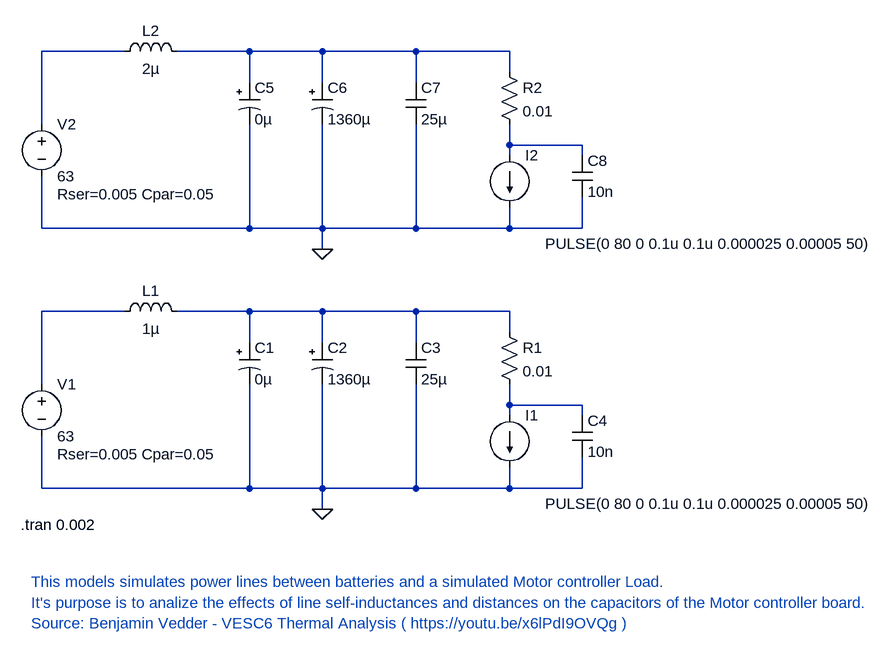
[diagram p0: schematic Motor_controller_power_line_001.asc]
Motor_controller_power_line_001.asc, the LTspice schematic file:
Version 4
SHEET 1 1240 680
WIRE -16 -416 -144 -416
WIRE 176 -416 64 -416
WIRE 288 -416 176 -416
WIRE 432 -416 288 -416
WIRE 576 -416 432 -416
WIRE 576 -384 576 -416
WIRE 176 -368 176 -416
WIRE 288 -368 288 -416
WIRE 432 -368 432 -416
WIRE -144 -304 -144 -416
WIRE 576 -272 576 -304
WIRE 688 -272 576 -272
WIRE 576 -256 576 -272
WIRE 688 -256 688 -272
WIRE -144 -144 -144 -224
WIRE 176 -144 176 -304
WIRE 176 -144 -144 -144
WIRE 288 -144 288 -304
WIRE 288 -144 176 -144
WIRE 432 -144 432 -304
WIRE 432 -144 288 -144
WIRE 576 -144 576 -176
WIRE 576 -144 432 -144
WIRE 688 -144 688 -192
WIRE 688 -144 576 -144
WIRE 288 -112 288 -144
WIRE -16 -16 -144 -16
WIRE 176 -16 64 -16
WIRE 288 -16 176 -16
WIRE 432 -16 288 -16
WIRE 576 -16 432 -16
WIRE 576 16 576 -16
WIRE 176 32 176 -16
WIRE 288 32 288 -16
WIRE 432 32 432 -16
WIRE -144 96 -144 -16
WIRE 576 128 576 96
WIRE 688 128 576 128
WIRE 576 144 576 128
WIRE 688 144 688 128
WIRE -144 256 -144 176
WIRE 176 256 176 96
WIRE 176 256 -144 256
WIRE 288 256 288 96
WIRE 288 256 176 256
WIRE 432 256 432 96
WIRE 432 256 288 256
WIRE 576 256 576 224
WIRE 576 256 432 256
WIRE 688 256 688 208
WIRE 688 256 576 256
WIRE 288 288 288 256
FLAG 288 288 0
FLAG 288 -112 0
SYMBOL voltage -144 80 R0
WINDOW 123 0 0 Left 2
WINDOW 39 24 124 Left 2
SYMATTR SpiceLine Rser=0.005 Cpar=0.05
SYMATTR InstName V1
SYMATTR Value 63
SYMBOL ind -32 0 R270
WINDOW 0 32 56 VTop 2
WINDOW 3 5 56 VBottom 2
SYMATTR InstName L1
SYMATTR Value 1µ
SYMATTR SpiceLine Rser=0.01
SYMBOL polcap 160 32 R0
SYMATTR InstName C1
SYMATTR Value 0µ
SYMATTR SpiceLine V=100 Rser=0.002 Lser=0.1u
SYMBOL polcap 272 32 R0
SYMATTR InstName C2
SYMATTR Value 1360µ
SYMATTR SpiceLine V=100 Rser=0.01 Lser=0.01u
SYMBOL cap 416 32 R0
SYMATTR InstName C3
SYMATTR Value 25µ
SYMATTR SpiceLine V=100 Rser=0.0002 Lser=0.001u
SYMBOL current 576 144 R0
WINDOW 3 55 136 Left 2
WINDOW 123 0 0 Left 2
WINDOW 39 0 0 Left 2
SYMATTR Value PULSE(0 80 0 0.1u 0.1u 0.000025 0.00005 50)
SYMATTR InstName I1
SYMBOL cap 672 144 R0
SYMATTR InstName C4
SYMATTR Value 10n
SYMATTR SpiceLine V=100 Rser=0.0002 Lser=0.001u
SYMBOL res 560 0 R0
SYMATTR InstName R1
SYMATTR Value 0.01
SYMBOL voltage -144 -320 R0
WINDOW 123 0 0 Left 2
WINDOW 39 24 124 Left 2
SYMATTR SpiceLine Rser=0.005 Cpar=0.05
SYMATTR InstName V2
SYMATTR Value 63
SYMBOL ind -32 -400 R270
WINDOW 0 32 56 VTop 2
WINDOW 3 5 56 VBottom 2
SYMATTR InstName L2
SYMATTR Value 2µ
SYMATTR SpiceLine Rser=0.01
SYMBOL polcap 160 -368 R0
SYMATTR InstName C5
SYMATTR Value 0µ
SYMATTR SpiceLine V=100 Rser=0.002 Lser=0.1u
SYMBOL polcap 272 -368 R0
SYMATTR InstName C6
SYMATTR Value 1360µ
SYMATTR SpiceLine V=100 Rser=0.01 Lser=0.01u
SYMBOL cap 416 -368 R0
SYMATTR InstName C7
SYMATTR Value 25µ
SYMATTR SpiceLine V=100 Rser=0.0002 Lser=0.001u
SYMBOL cap 672 -256 R0
SYMATTR InstName C8
SYMATTR Value 10n
SYMATTR SpiceLine V=100 Rser=0.0002 Lser=0.001u
SYMBOL res 560 -400 R0
SYMATTR InstName R2
SYMATTR Value 0.01
SYMBOL current 576 -256 R0
WINDOW 3 55 136 Left 2
WINDOW 123 0 0 Left 2
WINDOW 39 0 0 Left 2
SYMATTR Value PULSE(0 80 0 0.1u 0.1u 0.000025 0.00005 50)
SYMATTR InstName I2
TEXT -176 312 Left 2 !.tran 0.002
TEXT -160 400 Left 2 ;This models simulates power lines between batteries and a simulated Motor controller Load.
TEXT -160 432 Left 2 ;It's purpose is to analize the effects of line self-inductances and distances on the capacitors of the Motor controller board.
TEXT -160 464 Left 2 ;Source: Benjamin Vedder - VESC6 Thermal Analysis ( https://youtu.be/x6lPdI9OVQg )

The netlist it stands for:
* Motor_controller_power_line_001.asc
V1 N004 0 63 Rser=0.005 Cpar=0.05
L1 N004 N005 1µ Rser=0.01
C1 N005 0 0µ V=100 Rser=0.002 Lser=0.1u
C2 N005 0 1360µ V=100 Rser=0.01 Lser=0.01u
C3 N005 0 25µ V=100 Rser=0.0002 Lser=0.001u
I1 N006 0 PULSE(0 80 0 0.1u 0.1u 0.000025 0.00005 50)
C4 N006 0 10n V=100 Rser=0.0002 Lser=0.001u
R1 N005 N006 0.01
V2 N001 0 63 Rser=0.005 Cpar=0.05
L2 N001 N002 2µ Rser=0.01
C5 N002 0 0µ V=100 Rser=0.002 Lser=0.1u
C6 N002 0 1360µ V=100 Rser=0.01 Lser=0.01u
C7 N002 0 25µ V=100 Rser=0.0002 Lser=0.001u
C8 N003 0 10n V=100 Rser=0.0002 Lser=0.001u
R2 N002 N003 0.01
I2 N003 0 PULSE(0 80 0 0.1u 0.1u 0.000025 0.00005 50)
.tran 0.002
* This models simulates power lines between batteries and a simulated Motor controller Load.
* It's purpose is to analize the effects of line self-inductances and distances on the capacitors of the Motor controller board.
* Source: Benjamin Vedder - VESC6 Thermal Analysis ( https://youtu.be/x6lPdI9OVQg )
.backanno
.end